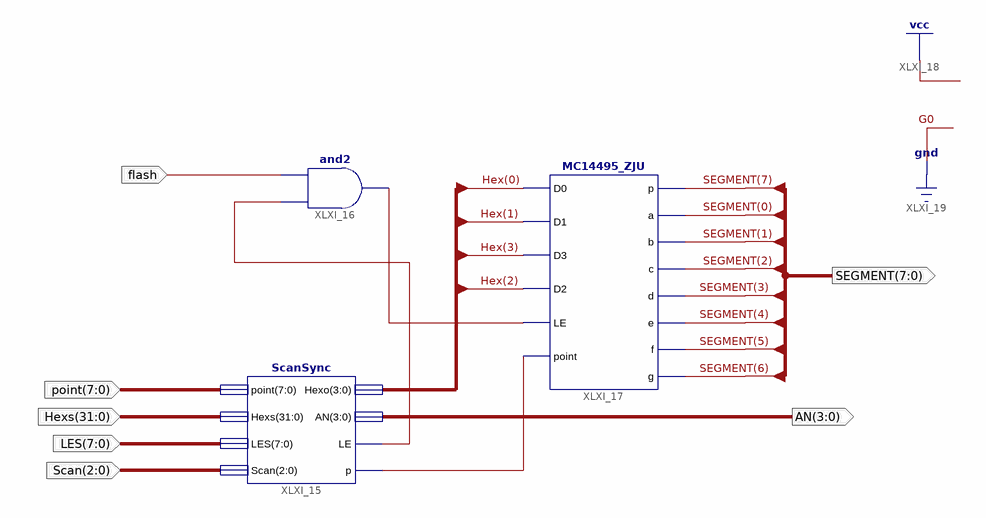
[diagram p0: schematic sheet 1]
// Xilinx ISE schematic Seg7_Dev.sch (kintex7) as structural Verilog: 3 symbols, 7 ports
module Seg7_Dev (
  input  [7:0] point,
  input  [31:0] Hexs,
  input  [7:0] LES,
  input  [2:0] Scan,
  input  flash,
  output [3:0] AN,
  output [7:0] SEGMENT
);

  wire XLXN_137, XLXN_138, XLXN_139;
  wire [3:0] Hex;

  ScanSync XLXI_15 (
    .point(point), .Hexs(Hexs), .LES(LES), .Scan(Scan), .Hexo(Hex), .AN(AN), .LE(XLXN_137), .p(XLXN_139));
  and XLXI_16 (XLXN_138, XLXN_137, flash);
  MC14495_ZJU XLXI_17 (
    .D0(Hex[0]), .D1(Hex[1]), .D3(Hex[3]), .D2(Hex[2]), .LE(XLXN_138), .point(XLXN_139), .p(SEGMENT[7]),
    .a(SEGMENT[0]), .b(SEGMENT[1]), .c(SEGMENT[2]), .d(SEGMENT[3]), .e(SEGMENT[4]), .f(SEGMENT[5]),
    .g(SEGMENT[6]));
endmodule
